# Altium schematic sheet XBee.SchDoc
size A
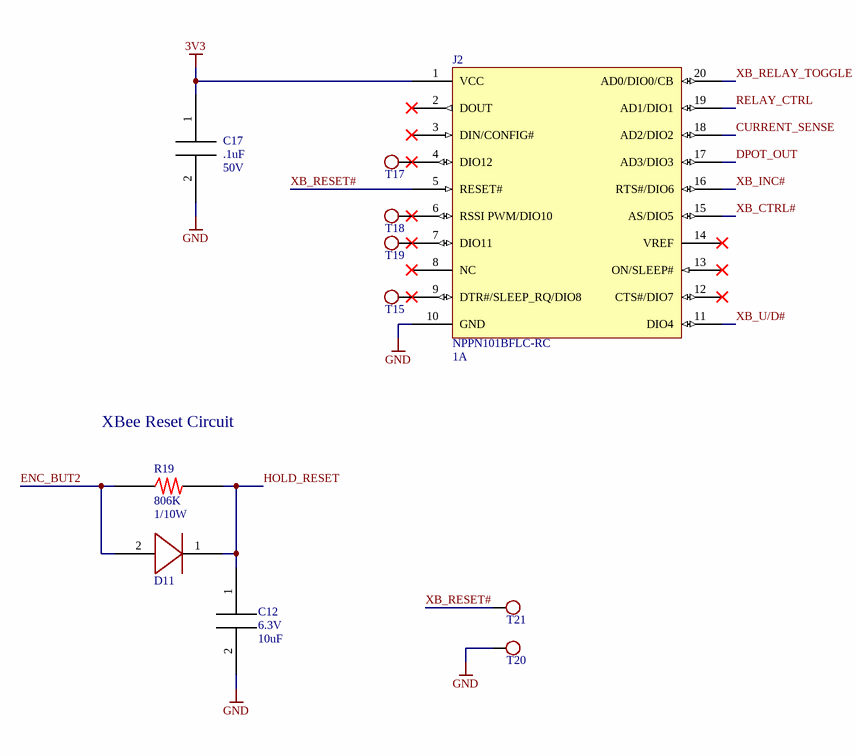
[diagram p0: XBee.SchDoc]

## Parts
C12  value 10uF  Rating: 6.3V  [0603]  (hidden comment: C_CAP_0603)
C17  value .1uF  Rating: 50V  [0603]  (hidden comment: C_CAP_0603)
D11  D_DIODE_SOD123  [SOD123]  (value not drawn)
J2  Rating: 1A  [NPPN101BFLC-RC]  (hidden comment: J_XBEE_NPPN101BFLC-RC)
R19  value 806K  Rating: 1/10W  [0603]  (hidden comment: R_RES_0603)
T15  TESTPOINT  [TESTPOINT1MM]  (value not drawn)
T17  TESTPOINT  [TESTPOINT1MM]  (value not drawn)
T18  TESTPOINT  [TESTPOINT1MM]  (value not drawn)
T19  TESTPOINT  [TESTPOINT1MM]  (value not drawn)
T20  TESTPOINT  [TESTPOINT1MM]  (value not drawn)
T21  TESTPOINT  [TESTPOINT1MM]  (value not drawn)

## Nets
3V3: C17.1 J2.1(VCC)
GND: C12.2 C17.2 J2.10(GND) T20.1
CURRENT_SENSE: J2.18(AD2/DIO2)
DPOT_OUT: J2.17(AD3/DIO3)
ENC_BUT2: D11.2 R19.1
HOLD_RESET: C12.1 D11.1 R19.2
RELAY_CTRL: J2.19(AD1/DIO1)
XB_CTRL#: J2.15(AS/DIO5)
XB_INC#: J2.16(RTS#/DIO6)
XB_RELAY_TOGGLE: J2.20(AD0/DIO0/CB)
XB_RESET#: J2.5(RESET#) T21.1
XB_U/D#: J2.11(DIO4)
NetJ2_4: J2.4(DIO12) T17.1
NetJ2_6: J2.6(RSSI_PWM/DIO10) T18.1
NetJ2_7: J2.7(DIO11) T19.1
NetJ2_9: J2.9(DTR#/SLEEP_RQ/DIO8) T15.1

Not connected (* = marked no-connect by the designer): J2 2(DOUT)* 3(DIN/CONFIG#)* 8(NC)* 12(CTS#/DIO7)* 13(ON/SLEEP#)* 14(VREF)*

## Notes on the sheet
- XBee Reset Circuit

## Library data of the parts
C12 = C_CAP_0603: PartNumber: JMK107ABJ106MA-T; Manufacturer: Taiyo Yuden
C17 = C_CAP_0603: PartNumber: C0603C104K5RACAUTO; Manufacturer: KEMET
D11 = D_DIODE_SOD123: PartNumber: BAS16GWJ; Manufacturer: Nexperia USA Inc; Rating: 215mA
J2 = J_XBEE_NPPN101BFLC-RC: Manufacturer: Sullins Connector Solutions; PartNumber: NPPN101BFLC-RC
R19 = R_RES_0603: PartNumber: RC0603FR-07806KL; Manufacturer: Yageo
T15 T17-T21 = T_TESTPOINT_TESTPOINT1MM: Value: 1mm